# Altium schematic sheet SCH_power.SchDoc
size A; DocumentNumber: 1; SheetNumber: 1; SheetTotal: 4
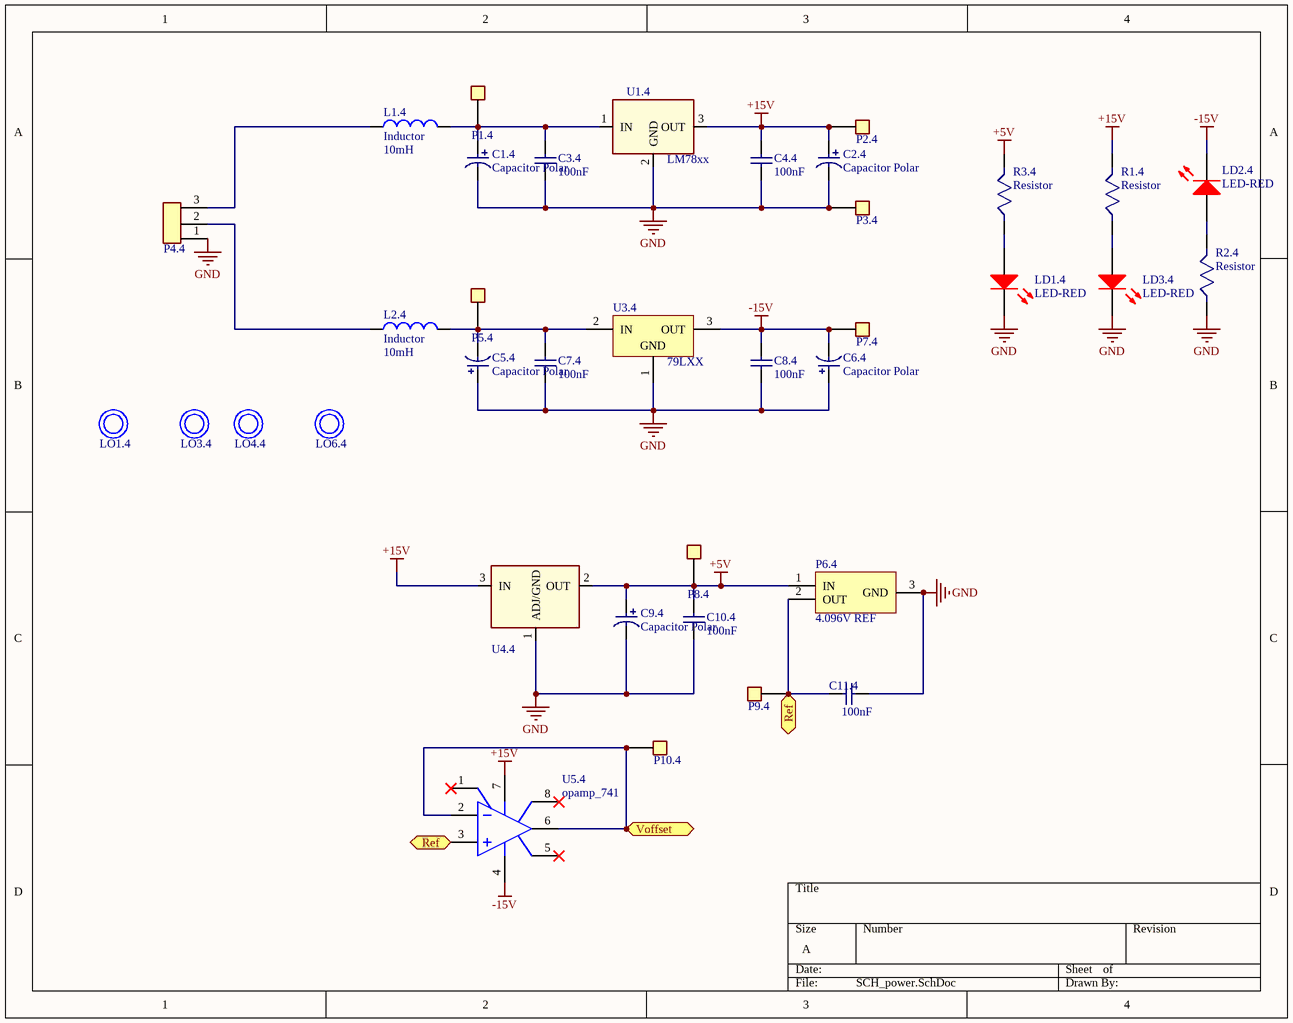
[diagram p0: SCH_power.SchDoc]

## Parts
C1.4  Capacitor Polar  [CAP_SMD_L=10.5]
C2.4  Capacitor Polar  [CAP_SMD_L=10.5]
C3.4  100nF  [C-NP-0805]
C4.4  100nF  [C-NP-0805]
C5.4  Capacitor Polar  [CAP_SMD_L=10.5]
C6.4  Capacitor Polar  [CAP_SMD_L=10.5]
C7.4  100nF  [C-NP-0805]
C8.4  100nF  [C-NP-0805]
C9.4  Capacitor Polar  [CAP_SMD_L=10.5]
C10.4  100nF  [C-NP-0805]
C11.4  100nF  [C-NP-0805]
L1.4  Inductor  value 10mH  [induction_coil]
L2.4  Inductor  value 10mH  [induction_coil]
LD1.4  LED-RED  [SMD 1206 RED]
LD2.4  LED-RED  [SMD 1206 RED]
LD3.4  LED-RED  [SMD 1206 RED]
LO1.4  LO KHOAN  [SP PCB]  (value not drawn)
LO3.4  LO KHOAN  [SP PCB]  (value not drawn)
LO4.4  LO KHOAN  [SP PCB]  (value not drawn)
LO6.4  LO KHOAN  [SP PCB]  (value not drawn)
P1.4  testpin  [tp_red_1p]  (value not drawn)
P2.4  testpin  [tp_red_1p]  (value not drawn)
P3.4  testpin  [Tp_black_1p]  (value not drawn)
P4.4  domino_3p  [domino_3p]  (value not drawn)
P5.4  testpin  [tp_red_1p]  (value not drawn)
P6.4  4.096V REF  [SOT233]
P7.4  testpin  [tp_red_1p]  (value not drawn)
P8.4  testpin  [tp_red_1p]  (value not drawn)
P9.4  testpin  [tp_red_1p]  (value not drawn)
P10.4  testpin  [tp_red_1p]  (value not drawn)
R1.4  Resistor  [RESC0805]
R2.4  Resistor  [RESC0805]
R3.4  Resistor  [RESC0805]
U1.4  LM78xx  [TO 220 THermal 25x25]
U3.4  79LXX  [TO 220 THermal 25x25]
U4.4  LM1117MP-3.3TR  [AMS1117]  (value not drawn)
U5.4  opamp_741  [SOIC-8_dan]

## Ports
Ref, Voffset

## Nets
+5V: C9.4.1 C10.4.1 P6.4.1(IN) P8.4.1 R3.4.2 U4.4.2(OUT)
+15V: C2.4.1 C4.4.1 P2.4.1 R1.4.2 U1.4.3(OUT) U4.4.3(IN) U5.4.7(V+)
-15V: C6.4.2 C8.4.1 LD2.4.2(K) P7.4.1 U3.4.3(OUT) U5.4.4(V-)
GND: C1.4.2 C2.4.2 C3.4.2 C4.4.2 C5.4.1 C6.4.1 C7.4.2 C8.4.2 C9.4.2 C10.4.2 C11.4.1 LD1.4.2(K) LD3.4.2(K) P3.4.1 P4.4.1 P6.4.3(GND) R2.4.1 U1.4.2(GND) U3.4.1(GND) U4.4.1(ADJ/GND)
Ref: C11.4.2 P6.4.2(OUT) P9.4.1 U5.4.3(IN+) ; port Ref
Voffset: P10.4.1 U5.4.2(IN-) U5.4.6(OUT) ; port Voffset
NetC1.4_1: C1.4.1 C3.4.1 L1.4.2 P1.4.1 U1.4.1(IN)
NetC5.4_2: C5.4.2 C7.4.1 L2.4.2 P5.4.1 U3.4.2(IN)
NetL1.4_1: L1.4.1 P4.4.3
NetL2.4_1: L2.4.1 P4.4.2
NetLD1.4_1: LD1.4.1(A) R3.4.1
NetLD2.4_1: LD2.4.1(A) R2.4.2
NetLD3.4_1: LD3.4.1(A) R1.4.1

Not connected (* = marked no-connect by the designer): U5.4 1(VOSTRIM)* 5(NC)* 8(VOSTRIM)*

## Library data of the parts
C1.4 C2.4 C5.4 C6.4 C9.4 = capacitor_polar 6.3x11mm
C3.4 C4.4 C7.4 C8.4 C10.4 C11.4 = capacitor_non_polar: capacitor non polar
L1.4 L2.4 = Inductor: Code_IEC: 1005; Published: 8-Jun-2000; LatestRevisionDate: 29-May-2009; LatestRevisionNote: IPC-7351 Footprint Added.; PackageReference: 0402-A; Publisher: Altium Limited; PackageDescription: Chip Inductor; Code_JEITA: 0402
LD1.4 LD2.4 LD3.4 = LED_LTST-C191KRKT: LED RED CLEAR 0603 SMD; Manufacturer: Lite-On Inc.; Lens Color: Colorless; Millicandela Rating: 54mcd; Lens Style/Size: Rectangle with Flat Top, 1.10mm x 0.80mm; Voltage - Forward (Vf) (Typ): 2V; Current - Test: 20mA; Viewing Angle: 130°; Wavelength - Dominant: 631nm; Wavelength - Peak: 639nm; Supplier 1: Digi-Key; Manufacturer Part Number: LTST-C191KRKT; RoHS: RoHS Compliant; Category: Optoelectronics; Stock 1: 711347; Pricing 1: 1=0.29, 10=0.211, 25=0.1556, 100=0.1111, 250=0.07556, 500=0.06666, 1000=0.05222, 2500=0.05111 (USD); Packaging: Digi-Reel®; Part Status: Active; Color: Red; Lens Transparency: Clear; Mounting Type: Surface Mount; Features: -; Size / Dimension: 1.60mm L x 0.80mm W; Height (Max): 0.65mm; ComponentLink1URL: http://optoelectronics.liteon.com/upload/download/DS22-2000-223/LTST-C191KRKT.PDF; ComponentLink1Description: http://optoelectronics.liteon.com/upload/download/DS22-2000-223/LTST-C191KRKT.PDF; Supplier Part Number 1: 160-1447-6-ND; Package / Case: 0603 (1608 Metric)
P6.4 = MCP1541T
U1.4 = LM78xx: Regulator; Manufacturer: Fairchild Semiconductor Corporation; PSpiceTemplate: X^@REFDES %IN %OUT %GND @MODEL; Vendor: Digikey; Output Current: Up to 1A; V out: 5V; Tolerance: 4 %; Value: LM7805CT; Published: 13-April-2009; Publisher: Hoang Nguyen; ComponentLink1Description: Digikey Part Link; ComponentLink2Description: Open Datasheet; ComponentLink2URL: H:\LIBRARY\LIBRARY.Datasheet\LM7805.pdf; Price: 2500 VND
U3.4 = LM79LXX: 3-Terminal Negative Regulator; Published: 15-Apr-2002; DatasheetVersion: Jul-1999; PackageVersion: 2000; PackageReference: Z03A; Publisher: Altium Limited; PackageDescription: TO, Flat Index; 3 In-Line, Axial Leads; Body Dia. 4.6mm; Leads 0.53 x 0.39 mm (max); ComponentLink1Description: Manufacturer Link; ComponentLink1URL: http://www.national.com/; ComponentLink2Description: Datasheet; ComponentLink2URL: http://www.national.com/ds.cgi/LM/LM320L.pdf; ComponentLink3Description: URL Link1; ComponentLink3URL: http://www.national.com/pf/LM/LM79L05.html
U4.4 = LM1117MP-3.3TR: 3.3V 800mA Low-Dropout Linear Regulator; PSpiceTemplate: X^@REFDES %IN %OUT %GND @MODEL; Vendor: Digikey; Volt (Max): 20V; Publisher: Hoang Nguyen; ComponentLink1URL: http://search.digikey.com/scripts/DkSearch/dksus.dll?Detail&name=LM1117MP-3.3TR-ND; ComponentLink1Description: Digikey Part Link; ComponentLink2Description: Open Datasheet; ComponentLink2URL: H:\LIBRARY\LIBRARY.Datasheet\LM1117.pdf; Published: 13-April-2009; V out: 3.3V; Output Current (max): 800mA; Price: 4.000 VND
U5.4 = opamp 741